# EAGLE schematic band-dsp-teensy (EAGLE 7.7.0)
DATABASE: /Users/ingolia/Dropbox/Experiments/turbidostat/nephelometer/circuitry/partsdb.txt
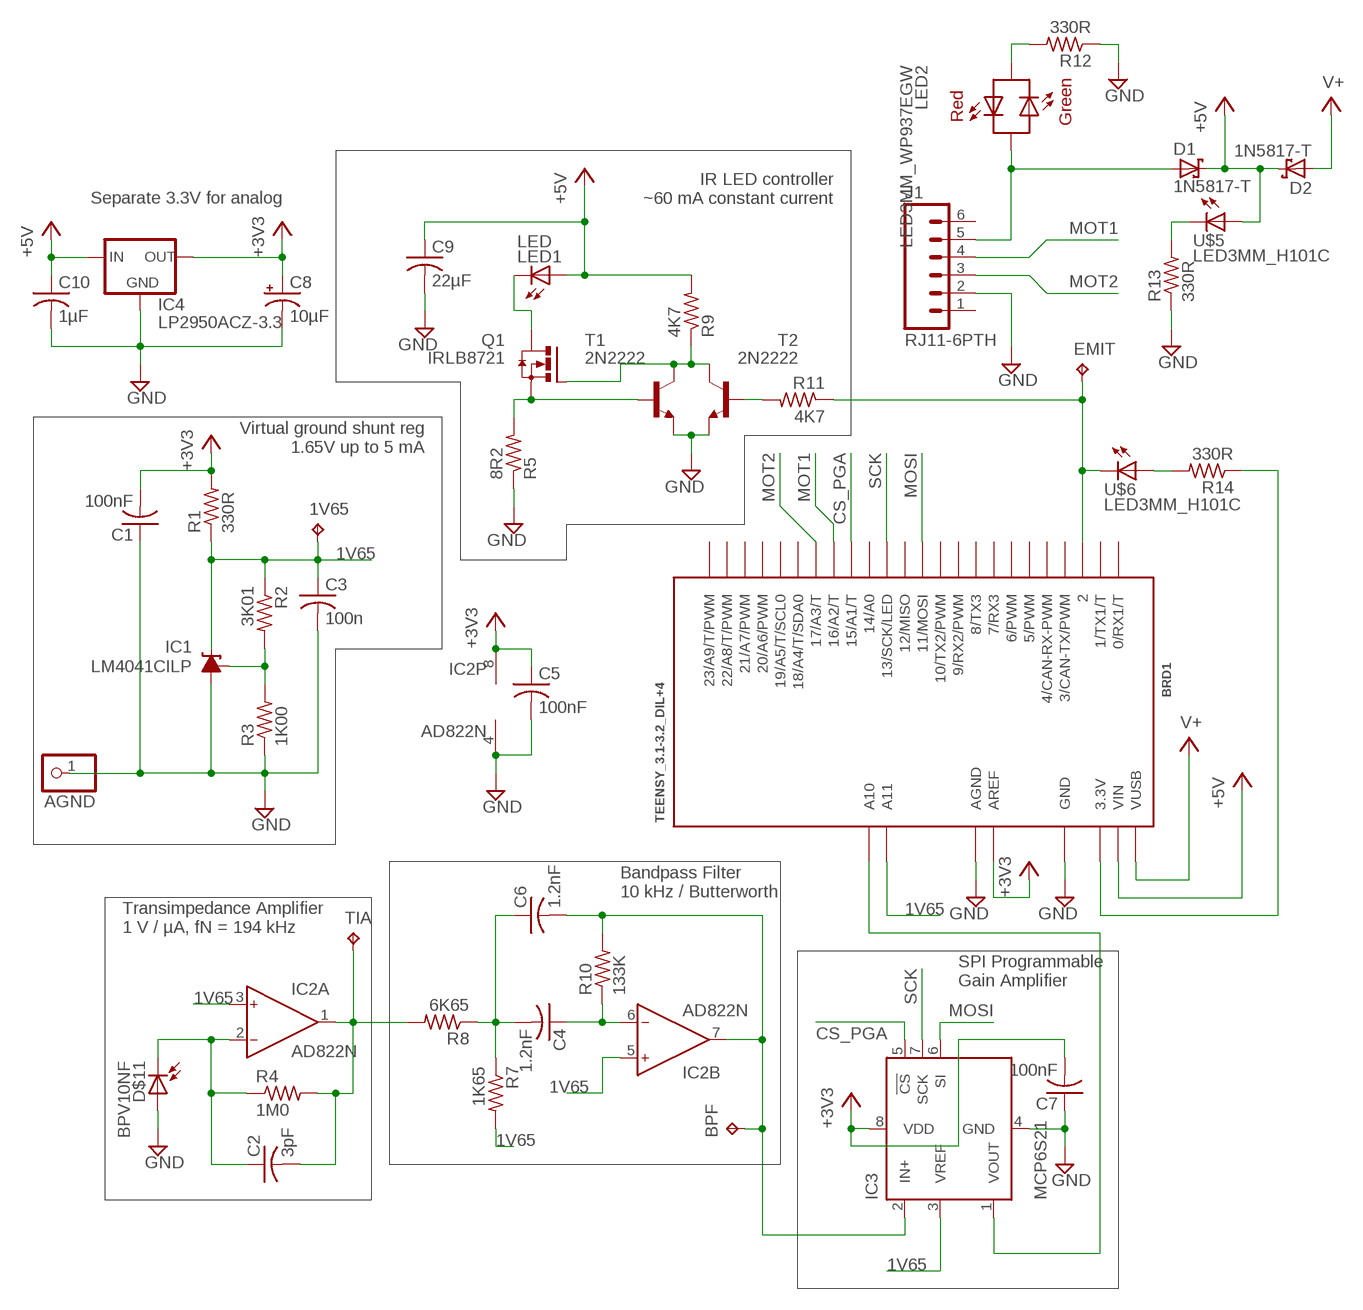
[diagram p0: schematic, sheet 1]

## Parts
1V65  TPTP10R  [TP10R]
AGND  PINHD-1X1  [1X01]
BPF  TPTP10R  [TP10R]
BRD1  TEENSY_3.1-3.2_DIL+4  [TEENSY_3.0-3.2&LC_DIL+4]
C1  100nF  C-US025-025X050  [C025-025X050]
C2  3pF  C-US025-024X044  [C025-024X044]
C3  100n  C-US025-025X050  [C025-025X050]
C4  1.2nF  C-US025-025X050  [C025-025X050]
C5  100nF  C-US025-025X050  [C025-025X050]
C6  1.2nF  C-US025-025X050  [C025-025X050]
C7  100nF  C-US025-025X050  [C025-025X050]
C8  10µF  CPOL-USE2.5-5  [E2,5-5]
C9  22µF  C-US050-045X075  [C050-045X075]
C10  1µF  C-US025-030X050  [C025-030X050]
D1  1N5817-T  [DO41-7.6]
D2  1N5817-T  [DO41-7.6]
D$11  BPV10NF  [LED5MM]
EMIT  TPPAD1-13  [P1-13]
IC1  LM4041CILP  [LP_O-PBCY-W3]
IC2  AD822N  [DIL08]
IC3  MCP6S21  [DIL08]
IC4  LP2950ACZ-3.3  [TO92]
J1  RJ11-6PTH  [RJ11-6]
LED1  LED  1X02_3.5MM_LED  [1X02_3.5MM]
LED2  LED3MM_WP937EGW  [LED3MM_H101C_BICOL]
Q1  IRLB8721  IRLB8721HORIZONTAL  [TO220BH]
R1  330R  R-US_0207/9  [0207/9]
R2  3K01  R-US_0207/9  [0207/9]
R3  1K00  R-US_0207/9  [0207/9]
R4  1M0  R-US_0207/9  [0207/9]
R5  8R2  R-US_0207/9  [0207/9]
R7  1K65  R-US_0207/9  [0207/9]
R8  6K65  R-US_0207/9  [0207/9]
R9  4K7  R-US_0207/9  [0207/9]
R10  133K  R-US_0207/9  [0207/9]
R11  4K7  R-US_0207/9  [0207/9]
R12  330R  R-US_0207/9  [0207/9]
R13  330R  R-US_0207/9  [0207/9]
R14  330R  R-US_0207/9  [0207/9]
T1  2N2222  [TO92-EBC-OVAL]
T2  2N2222  [TO92-EBC-OVAL]
TIA  TPTP10R  [TP10R]
U$5  LED3MM_H101C  [LED3MM_H101C]
U$6  LED3MM_H101C  [LED3MM_H101C]

## Nets
1V65: 1V65.TP BRD1.A11 C3.1 IC1.2(C) IC2.3(A:IN+) IC2.5(B:IN+) IC3.3(VREF) R1.1 R2.1 R7.2
+3V3: BRD1.AREF C1.2 C5.1 C7.2 C8.+ IC2.8(P:V+) IC3.8(VDD) IC4.1(OUT) R1.2
+5V: BRD1.VIN C9.1 C10.1 D1.C D2.C IC4.3(IN) LED1.1A(A) R9.2 U$5.A
CS_PGA: BRD1.15/A1(15/A1/T) IC3.5(!CS)
GND: AGND.1 BRD1.AGND BRD1.GND C1.1 C3.2 C5.2 C7.1 C8.- C9.2 C10.2 D$11.A IC1.3(A) IC2.4(P:V-) IC3.4(GND) IC4.2(GND) J1.2 R3.1 R5.1 R12.1 R13.1 T1.E T2.E
LEDCTRL: R11.2 T2.B
MOSI: BRD1.11(11/MOSI) IC3.6(SI)
MOT1: BRD1.16/A2(16/A2/T) J1.4
MOT2: BRD1.17/A3(17/A3/T) J1.3
N$1: C2.1 D$11.K IC2.2(A:IN-) R4.1
N$2: BRD1.3.3V R14.1
N$3: C4.2 C6.1 R7.1 R8.1
N$4: BRD1.A10 IC3.1(VOUT)
N$5: BRD1.2 EMIT.TP R11.1 U$6.K
N$6: BPF.TP C6.2 IC2.7(B:OUT) IC3.2(IN+) R10.2
N$7: R13.2 U$5.K
N$8: Q1.G R9.1 T1.C T2.C
N$9: C4.1 IC2.6(B:IN-) R10.1
N$10: D1.A J1.5 LED2.SHORT(GA)
N$11: R14.2 U$6.A
N$12: LED2.LONG(GK) R12.2
N$14: Q1.S R5.2 T1.B
N$18: LED1.2K(K) Q1.D
N$22: C2.2 IC2.1(A:OUT) R4.2 R8.2 TIA.TP
N$35: IC1.1(FB) R2.2 R3.2
SCK: BRD1.13(13/SCK/LED) IC3.7(SCK)
V+: BRD1.VUSB D2.A
Unconnected: BRD1.0(0/RX1/T) BRD1.1(1/TX1/T) BRD1.3(3/CAN-TX/PWM) BRD1.4(4/CAN-RX-PWM) BRD1.5(5/PWM) BRD1.6(6/PWM) BRD1.7(7/RX3) BRD1.8(8/TX3) BRD1.9(9/RX2/PWM) BRD1.10(10/TX2/PWM) BRD1.12(12/MISO) BRD1.14/A0 BRD1.18/A4(18/A4/T/SDA0) BRD1.19/A5(19/A5/T/SCL0) BRD1.20/A6(20/A6/PWM) BRD1.21/A7(21/A7/PWM) BRD1.22/A8(22/A8/T/PWM) BRD1.23/A9(23/A9/T/PWM) J1.1 J1.6

## Notes on the sheet
- Separate 3.3V for analog
- IR LED controller
  ~60 mA constant current
- Virtual ground shunt reg
  1.65V up to 5 mA
- Bandpass Filter
  10 kHz / Butterworth
- Transimpedance Amplifier
  1 V / µA, fN = 194 kHz
- SPI Programmable
  Gain Amplifier

## Library data of the parts
1V65 BPF EMIT TIA = testpad:TP: Test pad
AGND = adafruit:PINHD-1X1: Pin header 1x1 for 0.1" spacing With round pins
BRD1 = Teensy_3_and_LC_Series_Boards_v1.4:TEENSY_3.1-3.2_DIL+4: Teensy 3.1 and 3.2 in a DIL package with the inner 4 pins; DIGIKEY#: 1568-1231-ND; DIGIKEY2#: 300-1002-ND; DIGIKEY3#: SAM1198-14-ND; DIGIKEY4#: SAM1198-14-ND; DIGIKEY5#: S7038-ND; DIGIKEY6#: S7047-ND; DIGIKEY7#: S7047-ND; MANF: SparkFun Electronics; MANF#: DEV-13736; MANF2: Citizen Finedevice Co Ltd; MANF2#: CFS-20632768DZFB; MANF3: Samtec Inc.; MANF3#: SSQ-114-03-G-S; MANF4: Samtec Inc.; MANF4#: SSQ-114-03-G-S; MANF5: Sullins Connector Solutions; MANF5#: PPPC051LFBN-RC; MANF6: Sullins Connector Solutions; MANF6#: PPPC141LFBN-RC; MANF7: Sullins Connector Solutions; MANF7#: PPPC141LFBN-RC
C1 C3 C5 C7 = adafruit:C-US: CAPACITOR, American symbol; DIGIKEY#: BC1084CT-ND; MANF: Vishay BC Components; MANF#: K104K15X7RF5TL2
C2 = adafruit:C-US: CAPACITOR, American symbol; DIGIKEY#: 445-8377-ND; MANF: TDK Corporation; MANF#: FK18C0G1H030C
C4 C6 = adafruit:C-US: CAPACITOR, American symbol; DIGIKEY#: BC1026CT-ND; MANF: Vishay BC Components; MANF#: K122J15C0GF5TL2
C8 = adafruit:CPOL-US: POLARIZED CAPACITOR, American symbol; DIGIKEY#: 478-8042-1-ND; MANF: AVX Corporation; MANF#: TAP106K016SRW
C9 = adafruit:C-US: CAPACITOR, American symbol; DIGIKEY#: 445-8455-ND; MANF: TDK Corporation; MANF#: FK20X7R1C226M
C10 = adafruit:C-US: CAPACITOR, American symbol; DIGIKEY#: 445-5318-ND; MANF: TDK Corporation; MANF#: FK14X7R1C105K
D1 D2 = diode:1N581*: 1.0A SCHOTTKY BARRIER RECTIFIER Source: http://www.diodes.com/datasheets/ds23001.pdf; DIGIKEY#: 1N5817FSCT-ND; MANF: Fairchild Semiconductor; MANF#: 1N5817
D$11 = ingolia:BPV10NF; DIGIKEY#: 751-1002-ND; MANF: Vishay Semiconductor Opto Division; MANF#: BPV10NF
IC1 = texas:LM4041*I: PRECISION MICROPOWER SHUNT VOLTAGE REFERENCE Adjustable Output Source: http://focus.ti.com/lit/ds/slcs146e/slcs146e.pdf; DIGIKEY#: 296-22173-1-ND; MANF: Texas Instruments; MANF#: LM4041CILPR; MPN: LM4041CILP; OC_FARNELL: 1673945; OC_NEWARK: 50M8856
IC2 = analog-devices:AD822: Single-Supply, Rail-to-Rail Low Power FET-Input Op Amp Source: http://www.analog.com/static/imported-files/data_sheets/AD822.pdf; DIGIKEY#: AD823ANZ-ND; MANF: Analog Devices Inc.; MANF#: AD823ANZ; OC_FARNELL: 1438581; OC_NEWARK: unknown
IC3 = ingolia:MCP6S21; DIGIKEY#: MCP6S91-E/P-ND; MANF: Microchip Technology; MANF#: MCP6S91-E/P
IC4 = v-reg:LP2950?*: Source: http://cache.national.com/ds/LP/LP2950.pdf; DIGIKEY#: LP2950ACZ-3.3/NOPB-ND; MANF: Texas Instruments; MANF#: LP2950ACZ-3.3/NOPB
J1 = SparkFun-Connectors:RJ11-6: RJ11 Jack Simple 6 pin RJ11 jack. Commonly found on CAT3 devices and Microchip programmers. SKU: PRT-00132; DIGIKEY#: AE10383-ND; MANF: Assmann WSW Components; MANF#: A-2004-1-4-LP-N-R
LED1 = ingolia:1X02_3.5MM_LED; DIGIKEY#: 475-3002-ND; DIGIKEY2#: 492-1502-ND; DIGIKEY3#: ED2740-ND; MANF: OSRAM Opto Semiconductors Inc; MANF#: SFH 4547; MANF2: Bivar Inc; MANF2#: CR-174; MANF3: On Shore Technology Inc.; MANF3#: OSTTE020104
LED2 = ingolia:LED3MM_WP937EGW; DIGIKEY#: 754-1751-ND; DIGIKEY2#: 492-1789-ND; MANF: Kingbright; MANF#: WP937EGW; MANF2: Bivar Inc.; MANF2#: H-101C
Q1 = ingolia:IRLB8721; DIGIKEY#: IRLB8721PBF-ND; MANF: Infineon Technologies; MANF#: IRLB8721PBF
R1 R12 R13 = adafruit:R-US_: RESISTOR, American symbol; DIGIKEY#: CF14JT330RCT-ND; MANF: Stackpole Electronics Inc.; MANF#: CF14JT330R
R2 = adafruit:R-US_: RESISTOR, American symbol; DIGIKEY#: RNF14FTD3K01CT-ND; MANF: Stackpole Electronics Inc.; MANF#: RNF14FTD3K01
R3 = adafruit:R-US_: RESISTOR, American symbol; DIGIKEY#: RNF14FTD1K00CT-ND; MANF: Stackpole Electronics Inc.; MANF#: RNF14FTD1K00
R4 = adafruit:R-US_: RESISTOR, American symbol; DIGIKEY#: RNV14FAL1M00CT-ND; MANF: Stackpole Electronics Inc; MANF#: RNV14FAL1M00
R5 = adafruit:R-US_: RESISTOR, American symbol; DIGIKEY#: S8.2HCT-ND; MANF: Stackpole Electronics Inc.; MANF#: CFM12JT8R20
R7 = adafruit:R-US_: RESISTOR, American symbol; DIGIKEY#: 1.65KXBK-ND; MANF: Yageo; MANF#: MFR-25FBF52-1K65
R8 = adafruit:R-US_: RESISTOR, American symbol; DIGIKEY#: 6.65KXBK-ND; MANF: Yageo; MANF#: MFR-25FBF52-6K65
R9 R11 = adafruit:R-US_: RESISTOR, American symbol; DIGIKEY#: CF14JT4K70CT-ND; MANF: Stackpole Electronics Inc; MANF#: CF14JT4K70
R10 = adafruit:R-US_: RESISTOR, American symbol; DIGIKEY#: 133KXBK-ND; MANF: Yageo; MANF#: MFR-25FBF52-133K
R14 = adafruit:R-US_: RESISTOR, American symbol; DIGIKEY#: CF14JT150RCT-ND; MANF: Stackpole Electronics Inc.; MANF#: CF14JT150R
T1 T2 = adafruit:2N2222: NPN TRANSISTOR Big oval pads; DIGIKEY#: PN2222ATFCT-ND; MANF: Fairchild Semiconductor; MANF#: PN2222ATF
U$5 = ingolia:LED3MM_H101C; DIGIKEY#: 754-1595-ND; DIGIKEY2#: 492-1789-ND; MANF: Kingbright; MANF#: WP710A10CGCK; MANF2: Bivar Inc.; MANF2#: H-101C
U$6 = ingolia:LED3MM_H101C; DIGIKEY#: 754-1727-ND; DIGIKEY2#: 492-1789-ND; MANF: Kingbright; MANF#: WP710A10SYD; MANF2: Bivar Inc.; MANF2#: H-101C